# EAGLE board power_supply_module (EAGLE 8.2.0)
REV: D
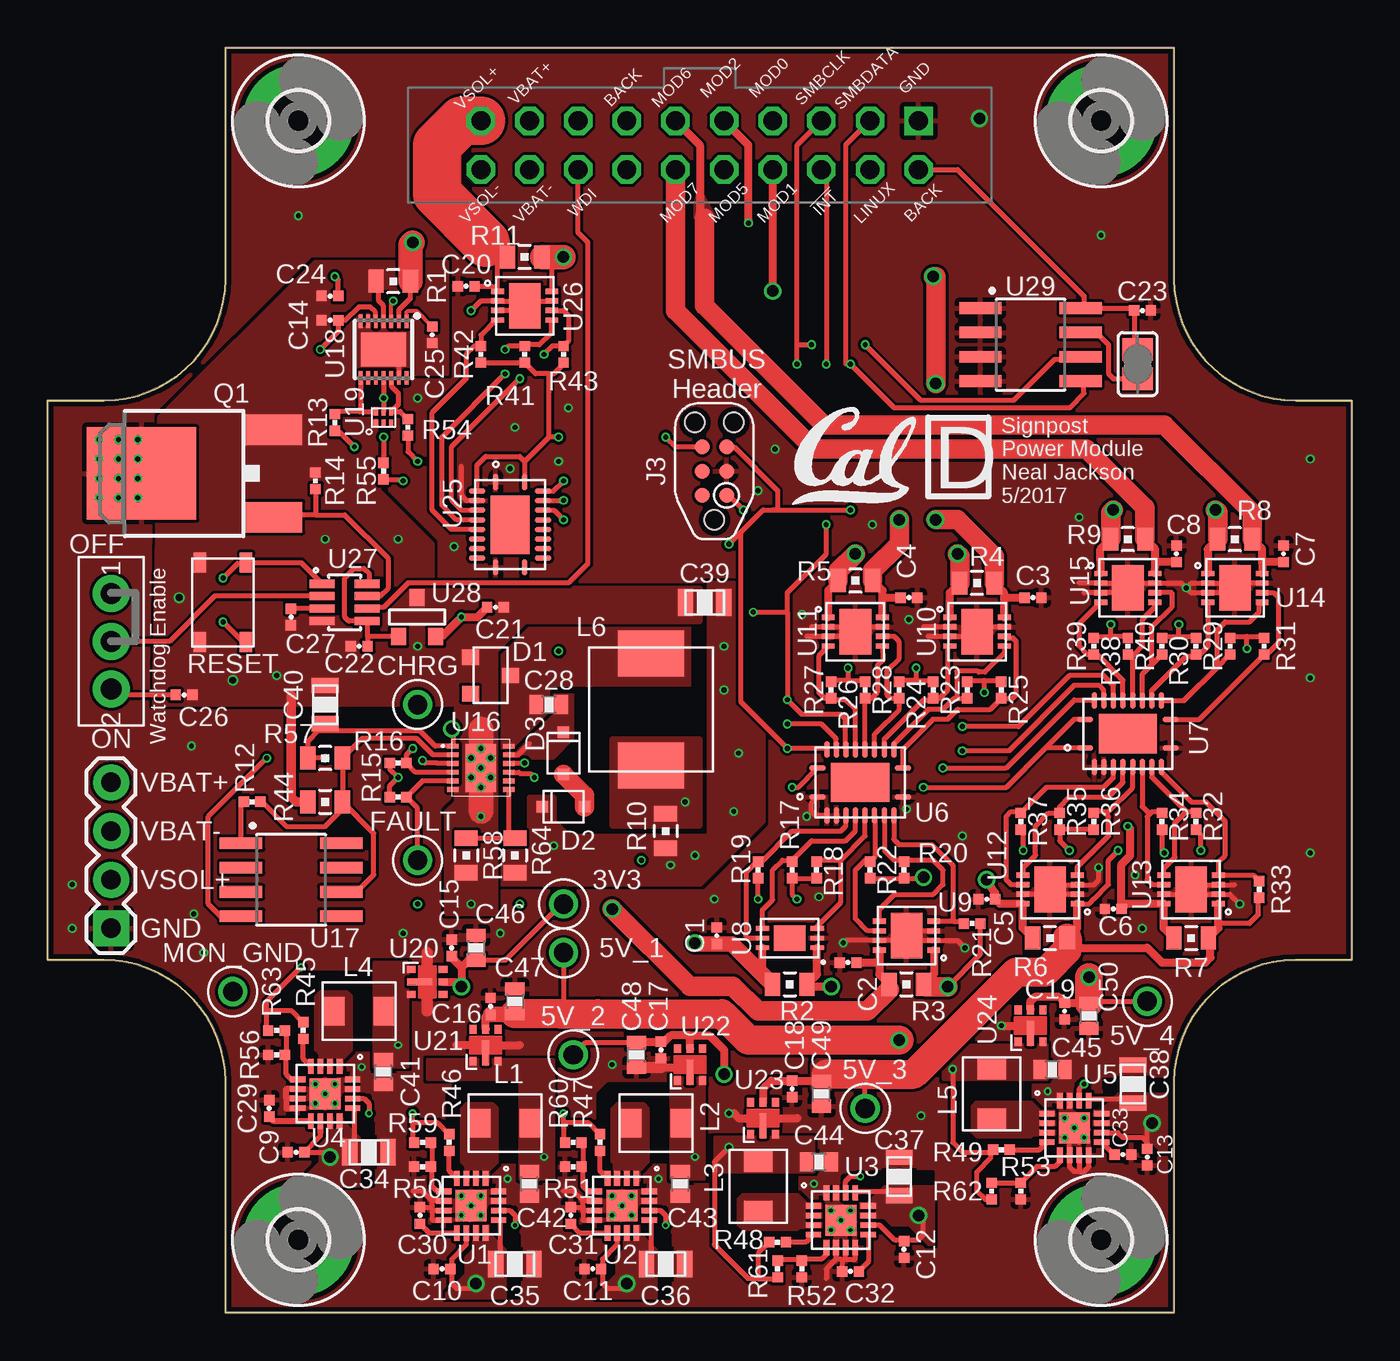
[diagram p8: board, top side]
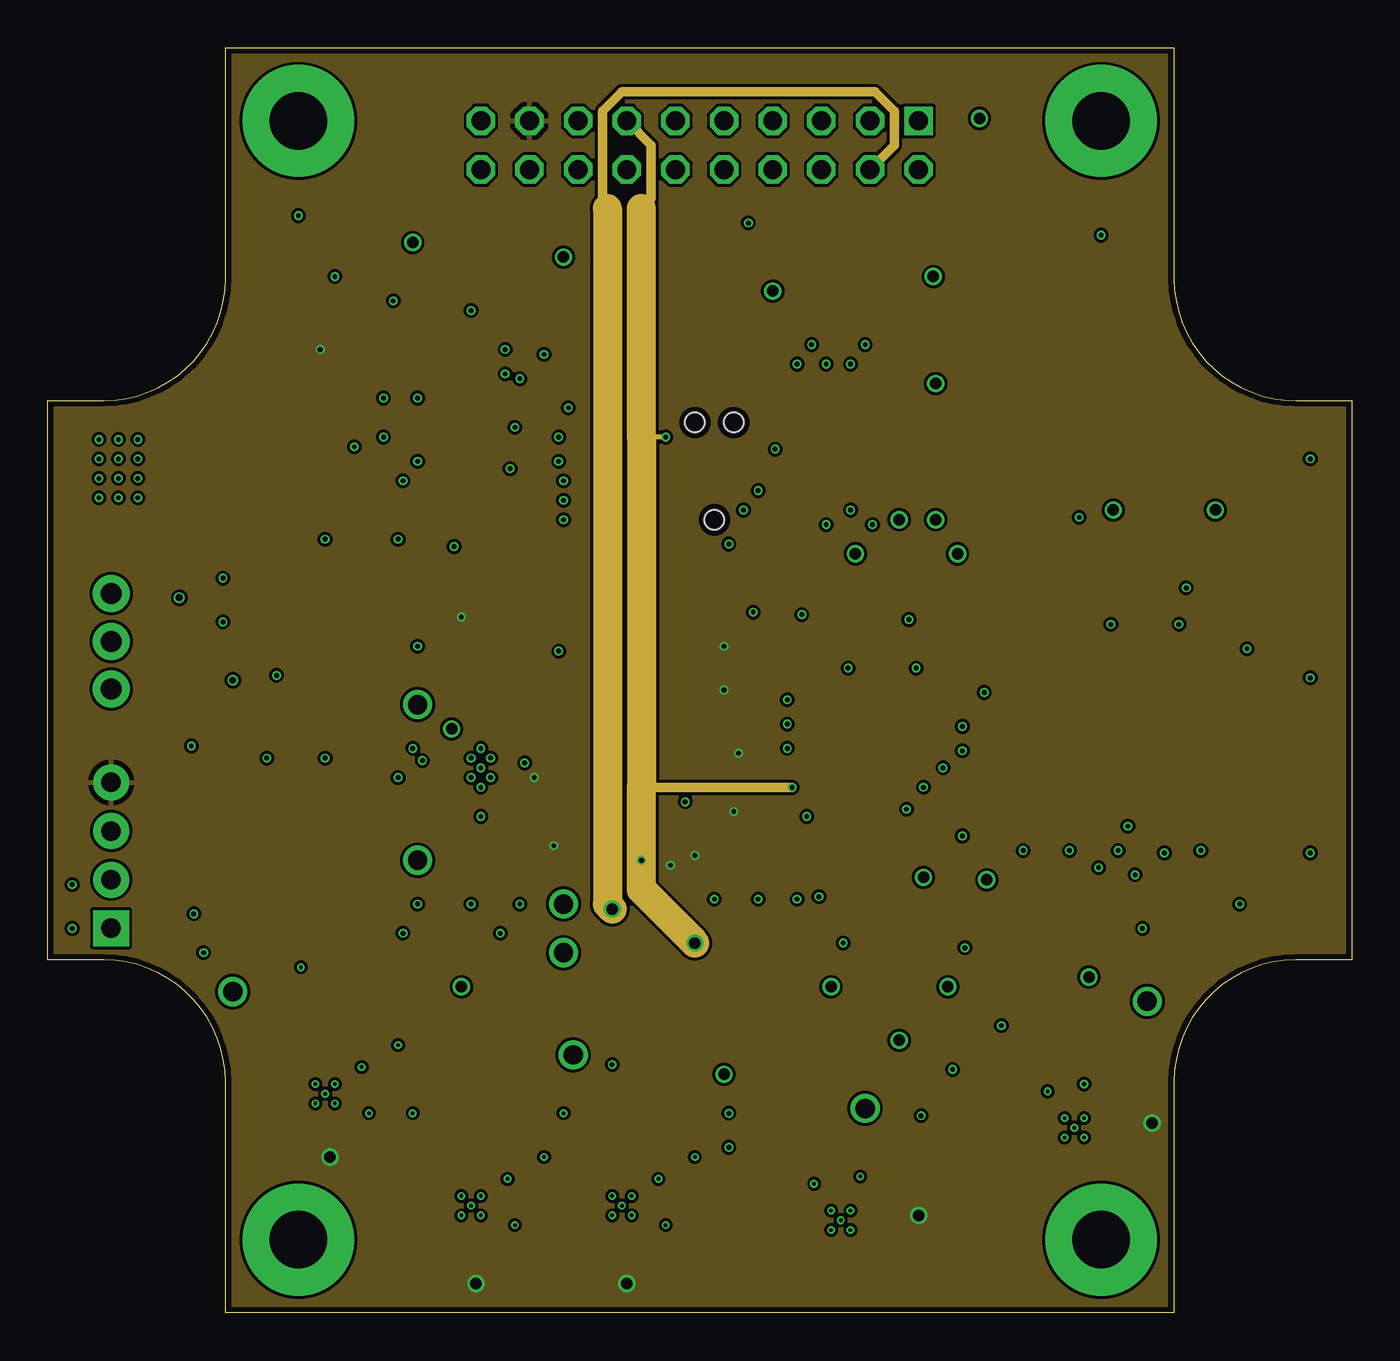
[diagram p9: board, inner layer Route2]
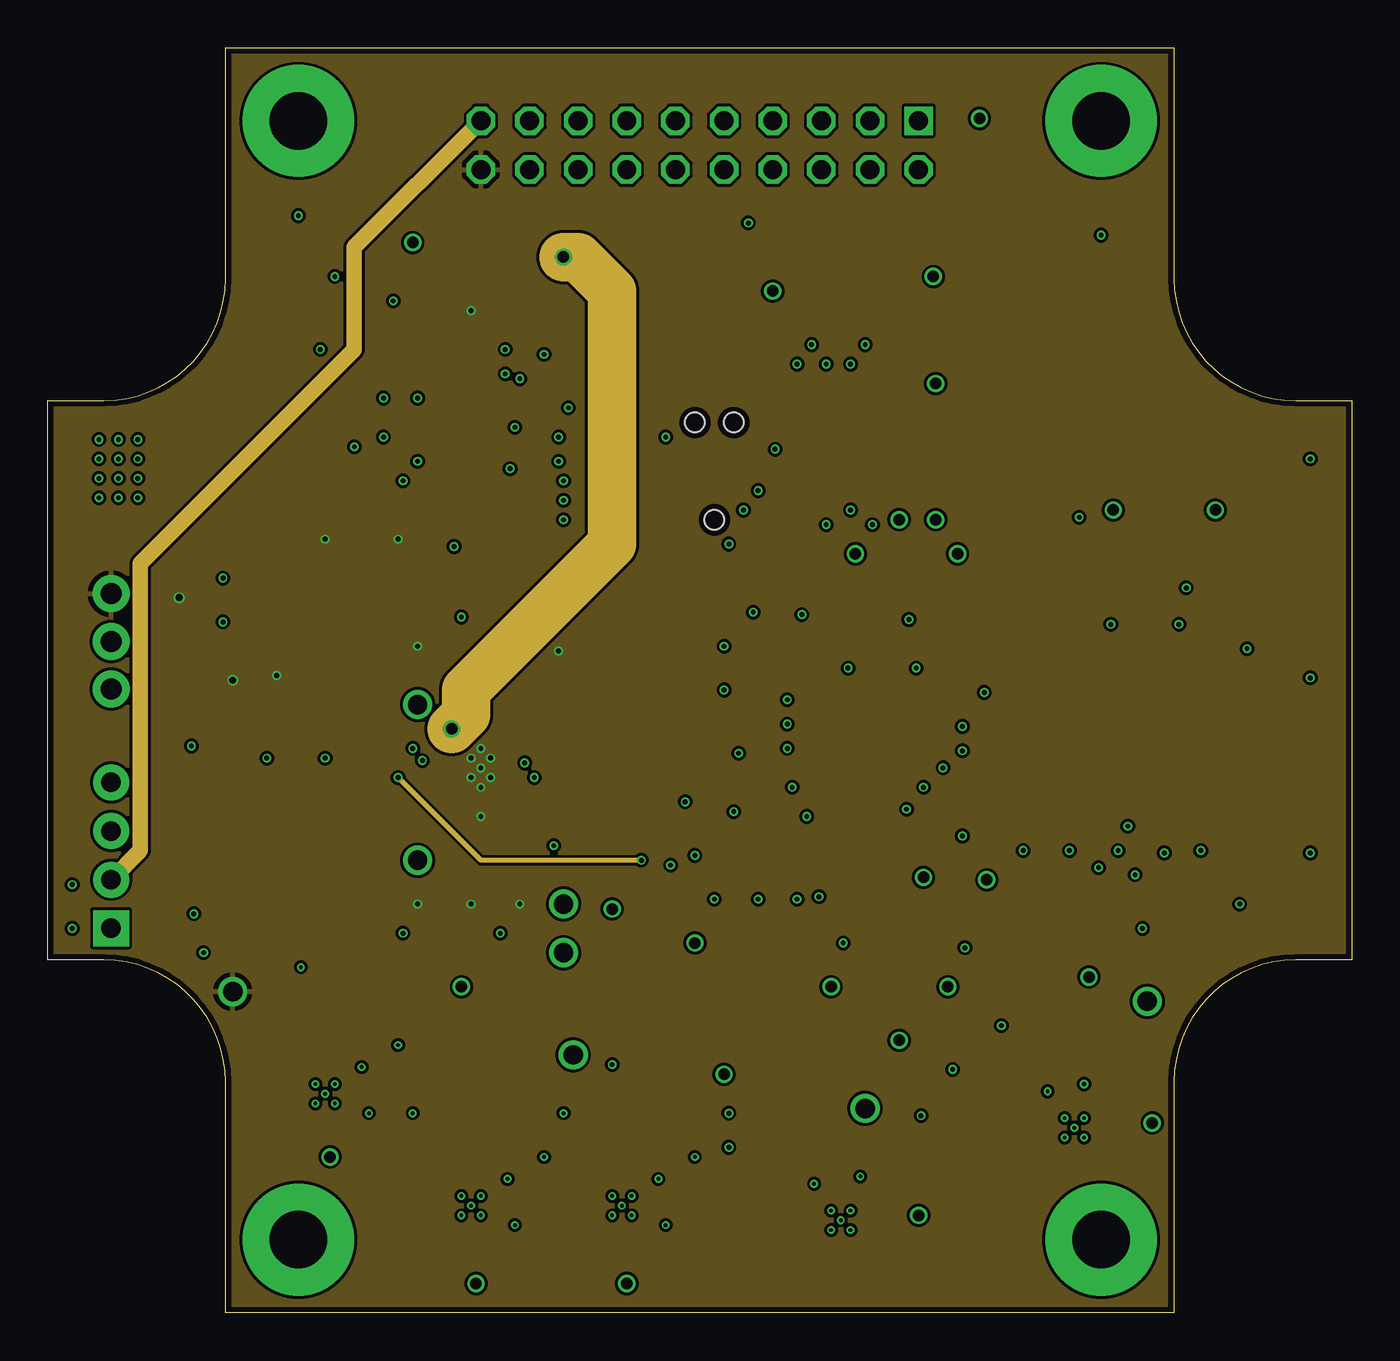
[diagram p10: board, inner layer Route15]
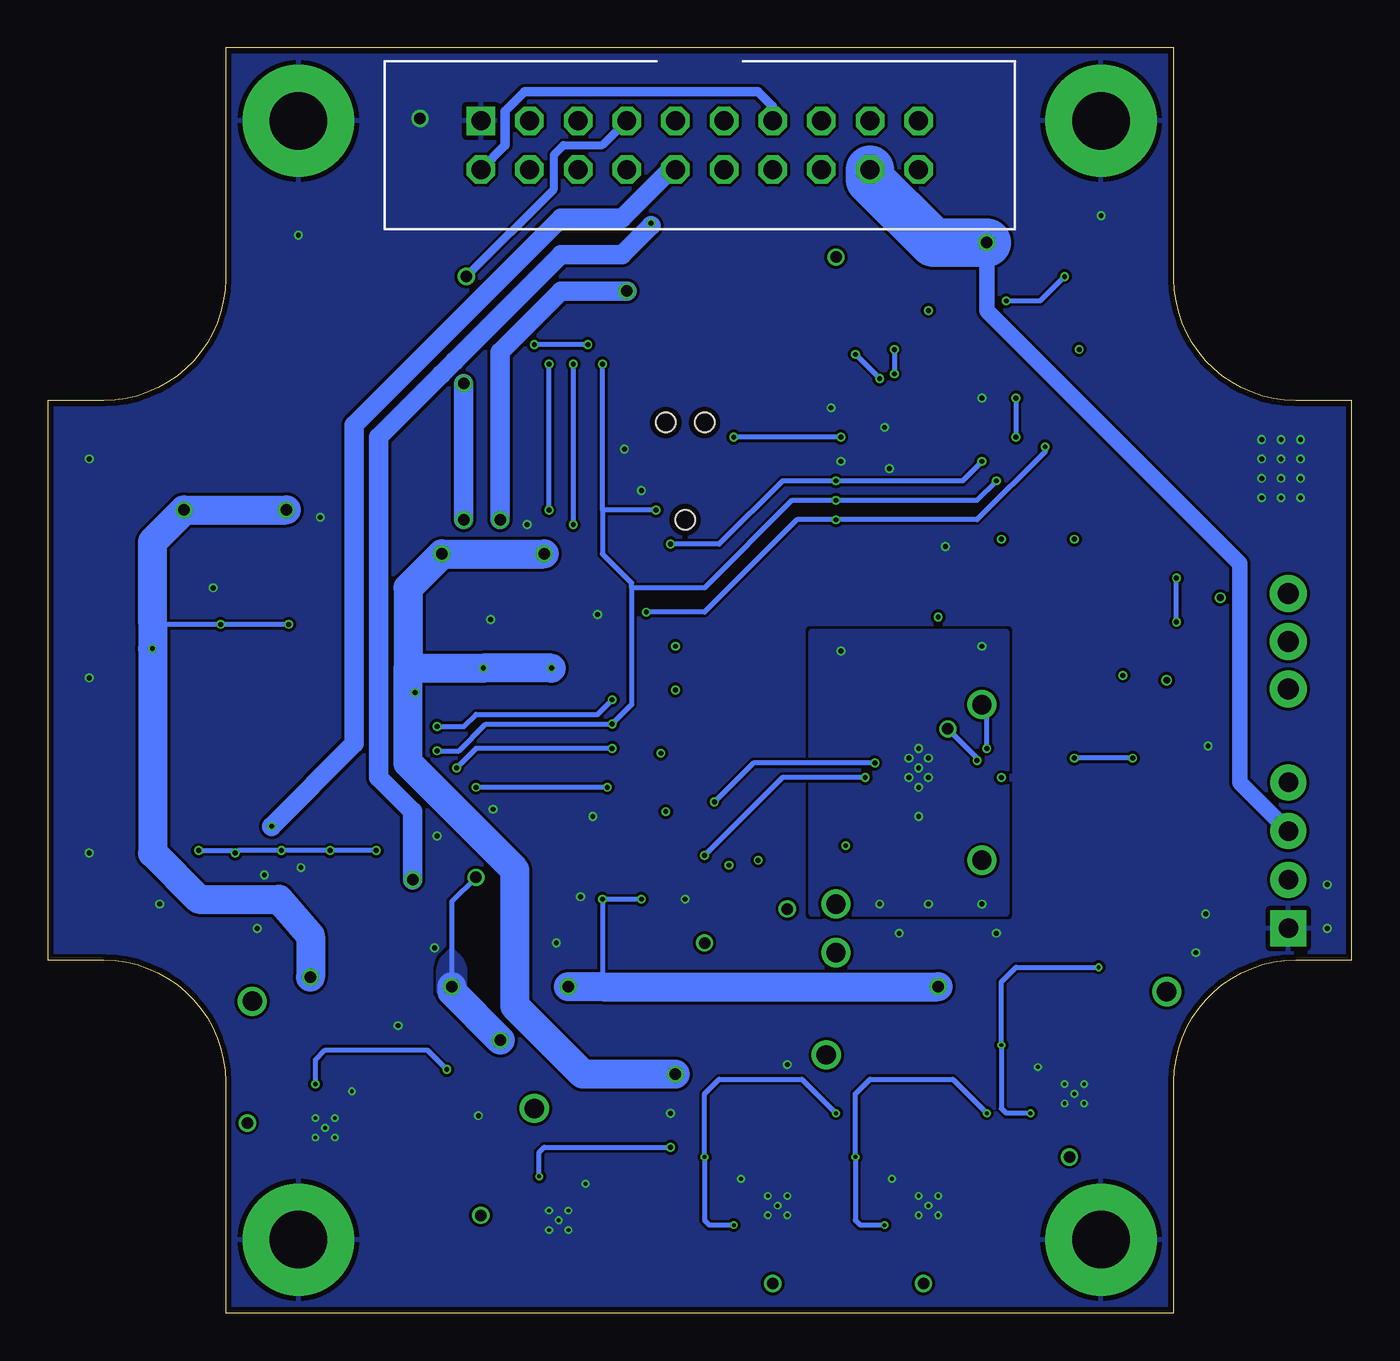
[diagram p11: board, bottom side, seen from below]

Size 68.07 x 66.04 mm. Coordinates in mm from the lower left corner, seen from the top.
Outline: 9.27,0 9.27,12.06 arc90 2.92,18.41 0,18.41 0,47.62 2.92,47.62 arc90 9.27,53.98 9.27,66.04 58.8,66.04 58.8,53.98 arc90 65.15,47.62 68.07,47.62 68.07,18.41 65.15,18.41 arc90 58.8,12.06 58.8,0 9.27,0
Copper layers (1+2*15+16): Top 0.0178mm / dielectric 59mil / Route2 0.0356mm / dielectric 0.1499mm / Route15 0.0356mm / dielectric 0.2007mm / Bottom 0.0178mm
Design rules "quickturn_co_kr_1oz_4lyr *": minimum track width 6mil, minimum drill 8mil, track to track 6mil, track to pad 6mil, pad to pad 6mil, via to via 6mil, smd to smd 6mil, copper to edge 12mil, drill to drill 12mil, minimum pad ring 8mil, minimum via ring 4mil, stop-mask expansion 3mil, vias tented up to drill 25mil, thermal gap 10mil
tRestrict: 46 lines

## Footprints (pad centres in the part's own frame; a part is rotated, then mirrored left to right if it is on the bottom)
TESTPOINT_0.040IN = drill 1.016: TESTPOINT 0,0
0402_CAP = smd 0.536 x 0.546: 1 -0.433,0; 2 0.433,0
0603_CAP = smd 0.7 x 1: 1 -0.65,0; 2 0.65,0
0805_CAP = smd 0.8 x 1.4: P$1 1,0; P$2 -1,0
SOT-23F = smd 0.8 x 0.9: P$1 -0.95,-1.05; P$2 0.95,-1.05; P$3 0,1.05
SOD323 = smd 0.6 x 0.6: P$1 -1.1,0; P$2 1.1,0
3,0-PAD = drill 3 pad 5.842: B3,0 0,0
MODULE_POWER = drill 0.991 square: 1 11.43,29.21 | drill 0.991 octagon: 2 11.43,26.67; 3 8.89,29.21; 4 8.89,26.67; 5 6.35,29.21; 6 6.35,26.67; 7 3.81,29.21; 8 3.81,26.67; 9 1.27,29.21; 10 1.27,26.67; 11 -1.27,29.21; 12 -1.27,26.67; 13 -3.81,29.21; 14 -3.81,26.67; 15 -6.35,29.21; 16 -6.35,26.67; 17 -8.89,29.21; 18 -8.89,26.67; 19 -11.43,29.21; 20 -11.43,26.67
TC2030-IDC-NL = smd 0.787 x 0.787: 1 -1.27,-0.635; 2 -1.27,0.635; 3 0,-0.635; 4 0,0.635; 5 1.27,-0.635; 6 1.27,0.635 | hole 1.016: -2.54,0; 2.54,1.016; 2.54,-1.016
1X04 = drill 1.016 pad 1.88 square: 1 0,0 | drill 1.016 pad 1.88: 2 2.54,0; 3 5.08,0; 4 7.62,0
IHL-1212BZ-11 = smd 1.2 x 1.5: P$1 -1.35,0; P$2 1.35,0
IHL-2525CZ = smd 2.413 x 3.429: P$1 -2.921,0; P$2 2.921,0
DPAK = smd 1.6 x 3: 1 -2.28,-5.31; 3 2.28,-5.31 | smd 4.826 x 5.715: 4 0,1.588
0805_RES = smd 0.8 x 1.2: 1 -0.9,0; 2 0.9,0
0402_RES = smd 0.536 x 0.546: 1 -0.433,0; 2 0.433,0
PTS810SJ = smd 1.05 x 0.65: 1 -2.075,1.2; 2 2.075,1.2; 3 2.075,-1.2; 4 -2.075,-1.2
TE_SSA12/SPDT = drill 1.092 pad 1.93: 1 -2.489,0; 2 2.489,0; IN 0,0
SJ = smd 1.168 x 1.6: 1 -0.762,0; 2 0.762,0
TQFN-16/3MM = smd 0.3 x 0.8: 1 -0.75,-1.43; 2 -0.25,-1.43; 3 0.25,-1.43; 4 0.75,-1.43; 9 0.75,1.43; 10 0.25,1.43; 11 -0.25,1.43; 12 -0.75,1.43 | smd 0.8 x 0.3: 5 1.43,-0.75; 6 1.43,-0.25; 7 1.43,0.25; 8 1.43,0.75; 13 -1.43,0.75; 14 -1.43,0.25; 15 -1.43,-0.25; 16 -1.43,-0.75 | smd 1.63 x 1.63: GND 0,0
QFN-N20 = smd 0.85 x 0.28: 1 -2.23,-0.75; 10 2.23,-0.75; 11 2.23,0.75; 20 -2.23,0.75 | smd 0.28 x 0.85: 2 -1.75,-1.73; 3 -1.25,-1.73; 4 -0.75,-1.73; 5 -0.25,-1.73; 6 0.25,-1.73; 7 0.75,-1.73; 8 1.25,-1.73; 9 1.75,-1.73; 12 1.75,1.73; 13 1.25,1.73; 14 0.75,1.73; 15 0.25,1.73; 16 -0.25,1.73; 17 -0.75,1.73; 18 -1.25,1.73; 19 -1.75,1.73 | smd 3.05 x 2.05: P$22 0,0
DFN-6-2MMX3MM = smd 0.25 x 0.7: 1 -0.5,-1.425; 2 0,-1.425; 3 0.5,-1.425; 4 0.5,1.425; 5 0,1.425; 6 -0.5,1.425 | smd 1.35 x 1.65: NC 0,0
DFN-8 = smd 0.28 x 0.675: P1 -0.75,-1.42; P2 -0.25,-1.42; P3 0.25,-1.42; P4 0.75,-1.42; P5 0.75,1.42; P6 0.25,1.42; P7 -0.25,1.42; P8 -0.75,1.42 | smd 2.38 x 1.65: P$1 0,0
DFN-12/3MM = smd 0.6 x 0.25: 1 -1.45,1.13; 2 -1.45,0.68; 3 -1.45,0.23; 4 -1.45,-0.23; 5 -1.45,-0.68; 6 -1.45,-1.13; 7 1.45,-1.13; 8 1.45,-0.68; 9 1.45,-0.23; 10 1.45,0.23; 11 1.45,0.68; 12 1.45,1.13 | smd 1.6 x 2.5: 13 0,0
SOIC-8 = smd 0.61 x 2.21: 1 -1.905,-2.616; 2 -0.635,-2.616; 3 0.635,-2.616; 4 1.905,-2.616; 5 1.905,2.616; 6 0.635,2.616; 7 -0.635,2.616; 8 -1.905,2.616
14-TDFN = smd 0.7 x 0.2: 1 -1.475,1.2; 2 -1.475,0.8; 3 -1.475,0.4; 4 -1.475,0; 5 -1.475,-0.4; 6 -1.475,-0.8; 7 -1.475,-1.2; 8 1.475,-1.2; 9 1.475,-0.8; 10 1.475,-0.4; 11 1.475,0; 12 1.475,0.4; 13 1.475,0.8; 14 1.475,1.2 | smd 1.78 x 2.35: 15 0,0
UDFN-6 = smd 0.42 x 0.22: P$1 -0.325,0.4; P$2 -0.325,0; P$3 -0.325,-0.4; P$4 0.325,-0.4; P$5 0.325,0; P$6 0.325,0.4
U-DFN2020-6 = smd 0.37 x 0.45: 1 -0.65,-0.825; 3 0.65,-0.825; 4 0.65,0.825; 5 0,0.825; 6 -0.65,0.825 | smd 0.37 x 1.3: 2 0,-0.4
SOT-23-8 = smd 0.42 x 1.3: 1 -0.975,-1.17; 2 -0.325,-1.17; 3 0.325,-1.17; 4 0.975,-1.17; 5 0.975,1.17; 6 0.325,1.17; 7 -0.325,1.17; 8 -0.975,1.17
SOT-23 = smd 0.787 x 0.889: 1 0.991,1.016; 2 -0.94,1.016; 3 0.025,-1.016

## Placement (x,y rotation side)
3V3  TEST_POINT_0.040IN  [TESTPOINT_0.040IN]  26.92,21.34 90 top
5V_1  TEST_POINT_0.040IN  [TESTPOINT_0.040IN]  26.92,18.8 90 top
5V_2  TEST_POINT_0.040IN  [TESTPOINT_0.040IN]  27.43,13.46 0 top
5V_3  TEST_POINT_0.040IN  [TESTPOINT_0.040IN]  42.67,10.67 90 top
5V_4  TEST_POINT_0.040IN  [TESTPOINT_0.040IN]  57.4,16.26 180 top
C1  0.1 uF  [0402_CAP]  34.92,19.68 90 top
C2  0.1 uF  [0402_CAP]  41.78,18.29 180 top
C3  0.1 uF  [0402_CAP]  51.44,37.34 0 top
C4  0.1 uF  [0402_CAP]  44.96,37.34 0 top
C5  0.1 uF  [0402_CAP]  49.02,21.59 180 top
C6  0.1 uF  [0402_CAP]  55.63,21.08 180 top
C7  0.1 uF  [0402_CAP]  64.52,39.62 90 top
C8  0.1 uF  [0402_CAP]  58.93,39.62 90 top
C9  0.1 uF  [0402_CAP]  12.95,8.38 180 top
C10  0.1 uF  [0402_CAP]  20.57,2.29 180 top
C11  0.1 uF  [0402_CAP]  28.45,2.29 180 top
C12  0.1 uF  [0402_CAP]  44.7,3.3 270 top
C13  0.1 uF  [0402_CAP]  57.4,8.13 270 top
C14  0.1 uF  [0402_CAP]  14.73,51.82 180 top
C15  0.1 uF  [0402_CAP]  21.08,19.05 90 top
C16  0.1 uF  [0402_CAP]  23.11,16 90 top
C17  0.1 uF  [0402_CAP]  32,13.72 270 top
C18  0.1 uF  [0402_CAP]  38.86,11.68 270 top
C19  0.1 uF  [0402_CAP]  53.09,15.75 270 top
C20  0.1 uF  [0402_CAP]  21.84,53.59 180 top
C21  0.1 uF  [0402_CAP]  23.37,36.83 0 top
C22  0.1 uF  [0402_CAP]  16.26,34.8 180 top
C23  0.1 uF  [0402_CAP]  57.15,52.32 0 top
C24  0.47 uF  [0402_CAP]  14.73,53.09 180 top
C25  0.47 uF  [0402_CAP]  20.07,51.05 270 top
C26  0.47 uF  [0402_CAP]  7.11,32.26 0 top
C27  0.82 uF  [0402_CAP]  12.7,36.32 270 top
C28  1 uF  [0603_CAP]  26.16,31.75 0 top
C29  3.3 nF  [0402_CAP]  11.56,10.67 270 top
C30  3.3 nF  [0402_CAP]  19.43,5.08 270 top
C31  3.3 nF  [0402_CAP]  27.3,5.08 270 top
C32  3.3 nF  [0402_CAP]  41.91,2.16 0 top
C33  3.3 nF  [0402_CAP]  56.13,8.26 180 top
C34  10 uF  [0805_CAP]  16.76,8.38 180 top
C35  10 uF  [0805_CAP]  24.38,2.54 180 top
C36  10 uF  [0805_CAP]  32.26,2.54 180 top
C37  10 uF  [0805_CAP]  44.45,7.11 270 top
C38  10 uF  [0805_CAP]  56.64,11.94 270 top
C39  10 uF  [0805_CAP]  34.29,37.08 0 top
C40  10 uF  [0805_CAP]  14.48,31.75 270 top
C41  22 uF  [0603_CAP]  17.53,12.57 90 top
C42  22 uF  [0603_CAP]  25.15,6.73 90 top
C43  22 uF  [0603_CAP]  33.02,6.73 90 top
C44  22 uF  [0603_CAP]  40.26,7.87 180 top
C45  22 uF  [0603_CAP]  52.45,12.7 180 top
C46  22 uF  [0603_CAP]  22.35,19.05 270 top
C47  22 uF  [0603_CAP]  24.38,16.26 270 top
C48  22 uF  [0603_CAP]  30.73,13.46 90 top
C49  22 uF  [0603_CAP]  40.39,11.43 90 top
C50  22 uF  [0603_CAP]  54.36,15.49 90 top
CHRG  TEST_POINT_0.040IN  [TESTPOINT_0.040IN]  19.3,31.75 0 top
D1  DIODE_SCHOTTKYSOT-23F  [SOT-23F]  23.11,33.27 270 top
D2  [SOD323]  26.92,26.42 0 top
D3  DIODE_SCHOTTKYSOD323  [SOD323]  26.92,29.21 270 top
FAULT  TEST_POINT_0.040IN  [TESTPOINT_0.040IN]  19.3,23.62 0 top
H1  MOUNT-PAD-ROUND3.0  [3,0-PAD]  13.08,62.23 0 top
H2  MOUNT-PAD-ROUND3.0  [3,0-PAD]  54.99,62.23 0 top
H3  MOUNT-PAD-ROUND3.0  [3,0-PAD]  13.08,3.81 0 top
H4  MOUNT-PAD-ROUND3.0  [3,0-PAD]  54.99,3.81 0 top
J1  MODULE_POWER  [MODULE_POWER]  34.04,33.02 0 top
J3  TC2030-FTDI-I2C  [TC2030-IDC-NL]  34.8,43.94 90 top
JP1  [1X04]  3.3,20.07 90 top
L1  2.2 uH  [IHL-1212BZ-11]  23.88,9.91 0 top
L2  2.2 uH  [IHL-1212BZ-11]  31.75,9.91 0 top
L3  2.2 uH  [IHL-1212BZ-11]  37.08,6.6 90 top
L4  2.2 uH  [IHL-1212BZ-11]  16.26,15.75 0 top
L5  2.2 uH  [IHL-1212BZ-11]  49.28,11.43 90 top
L6  6.8uH  [IHL-2525CZ]  31.5,31.5 270 top
MON_GND  TEST_POINT_0.040IN  [TESTPOINT_0.040IN]  9.65,16.76 0 top
Q1  MOSFET-NCHANNELFDD8580  [DPAK]  6.48,43.81 90 top
R1  0.010 Ω  [0805_RES]  18.03,53.85 180 top
R2  0.017 Ω  [0805_RES]  38.73,17.14 0 top
R3  0.017 Ω  [0805_RES]  44.83,17.14 0 top
R4  0.017 Ω  [0805_RES]  48.51,38.1 180 top
R5  0.017 Ω  [0805_RES]  42.16,38.23 180 top
R6  0.017 Ω  [0805_RES]  52.32,19.56 0 top
R7  0.017 Ω  [0805_RES]  59.69,19.56 0 top
R8  0.017 Ω  [0805_RES]  61.98,40.39 180 top
R9  0.017 Ω  [0805_RES]  56.39,40.39 180 top
R10  0.05 Ω  [0805_RES]  32.26,25.15 270 top
R11  0.05 Ω  [0805_RES]  24.89,55.12 180 top
R12  1 kΩ  [0402_RES]  10.67,26.67 180 top
R13  1 kΩ  [0402_RES]  14.99,46.48 270 top
R14  1 MΩ  [0402_RES]  13.97,43.43 270 top
R15  1 MΩ  [0402_RES]  18.29,26.92 180 top
R16  1 MΩ  [0402_RES]  18.29,28.7 180 top
R17  2 kΩ  [0402_RES]  38.86,23.11 270 top
R18  2 kΩ  [0402_RES]  40.13,23.11 270 top
R19  2 kΩ  [0402_RES]  37.08,23.11 270 top
R20  2 kΩ  [0402_RES]  44.7,23.11 270 top
R21  2 kΩ  [0402_RES]  48.26,20.32 0 top
R22  2 kΩ  [0402_RES]  42.93,23.11 270 top
R23  2 kΩ  [0402_RES]  48.01,32.51 90 top
R24  2 kΩ  [0402_RES]  46.23,32.51 90 top
R25  2 kΩ  [0402_RES]  49.78,32.51 90 top
R26  2 kΩ  [0402_RES]  42.67,32.51 90 top
R27  2 kΩ  [0402_RES]  40.89,32.51 90 top
R28  2 kΩ  [0402_RES]  44.45,32.51 90 top
R29  2 kΩ  [0402_RES]  61.72,34.8 90 top
R30  2 kΩ  [0402_RES]  59.94,34.8 90 top
R31  2 kΩ  [0402_RES]  63.5,34.8 90 top
R32  2 kΩ  [0402_RES]  59.94,25.65 270 top
R33  2 kΩ  [0402_RES]  63.25,22.1 270 top
R34  2 kΩ  [0402_RES]  58.17,25.65 270 top
R35  2 kΩ  [0402_RES]  52.83,25.65 270 top
R36  2 kΩ  [0402_RES]  54.61,25.65 270 top
R37  2 kΩ  [0402_RES]  50.8,25.65 270 top
R38  2 kΩ  [0402_RES]  56.39,34.8 90 top
R39  2 kΩ  [0402_RES]  54.61,34.8 90 top
R40  2 kΩ  [0402_RES]  58.17,34.8 90 top
R41  2 kΩ  [0402_RES]  24.89,50.04 270 top
R42  2 kΩ  [0402_RES]  22.61,50.04 270 top
R43  2 kΩ  [0402_RES]  26.92,50.04 270 top
R44  23.2 kΩ  [0805_RES]  14.48,26.67 0 top
R45  100 kΩ  [0402_RES]  13.34,14.73 90 top
R46  100 kΩ  [0402_RES]  20.95,8.89 90 top
R47  100 kΩ  [0402_RES]  28.83,8.89 90 top
R48  100 kΩ  [0402_RES]  38.1,3.68 180 top
R49  100 kΩ  [0402_RES]  49.78,8.51 180 top
R50  130 kΩ  [0402_RES]  19.56,7.62 0 top
R51  130 kΩ  [0402_RES]  27.43,7.62 0 top
R52  130 kΩ  [0402_RES]  39.37,2.29 90 top
R53  130 kΩ  [0402_RES]  50.8,6.35 90 top
R54  150 Ω  [0402_RES]  18.8,46.23 270 top
R55  150 Ω  [0402_RES]  17.53,43.94 270 top
R56  240 kΩ  [0402_RES]  11.94,13.46 0 top
R57  301 kΩ  [0805_RES]  14.48,28.96 180 top
R58  340 kΩ  [0805_RES]  21.84,23.88 270 top
R59  680 kΩ  [0402_RES]  19.56,8.89 180 top
R60  680 kΩ  [0402_RES]  27.43,8.89 180 top
R61  680 kΩ  [0402_RES]  38.1,2.29 270 top
R62  680 kΩ  [0402_RES]  49.28,6.35 270 top
R63  750 kΩ  [0402_RES]  11.94,14.73 180 top
R64  953 kΩ  [0805_RES]  24.38,23.88 270 top
RESET  PTS810SJ  [PTS810SJ]  9.14,37.08 270 top
S1  TE_SSA12/SPDT  [TE_SSA12/SPDT]  3.3,35.05 270 top
SJ1  [SJ]  56.9,49.53 270 top
U1  TLV62130  [TQFN-16/3MM]  22.1,5.59 180 top
U2  TLV62130  [TQFN-16/3MM]  29.97,5.59 180 top
U3  TLV62130  [TQFN-16/3MM]  41.4,4.83 270 top
U4  TLV62130  [TQFN-16/3MM]  14.48,11.43 180 top
U5  TLV62130  [TQFN-16/3MM]  53.59,9.65 270 top
U6  PCA9544AQFN-N20  [QFN-N20]  42.42,27.69 0 top
U7  PCA9544AQFN-N20  [QFN-N20]  56.39,30.23 0 top
U8  LTC2941  [DFN-6-2MMX3MM]  38.73,19.56 90 top
U9  LTC2943  [DFN-8]  44.83,19.68 90 top
U10  LTC2943  [DFN-8]  48.51,35.56 270 top
U11  LTC2943  [DFN-8]  42.16,35.56 270 top
U12  LTC2943  [DFN-8]  52.32,22.1 90 top
U13  LTC2943  [DFN-8]  59.69,22.1 90 top
U14  LTC2943  [DFN-8]  61.98,37.85 270 top
U15  LTC2943  [DFN-8]  56.39,37.85 270 top
U16  LT3652  [DFN-12/3MM]  22.61,28.45 0 top
U17  LM234  [SOIC-8]  12.7,22.61 270 top
U18  MAX17205  [14-TDFN]  17.53,50.29 270 top
U19  ESDR0502N  [UDFN-6]  17.53,46.74 90 top
U20  AP22814  [U-DFN2020-6]  19.81,17.27 270 top
U21  AP22814  [U-DFN2020-6]  22.86,13.97 0 top
U22  AP22814  [U-DFN2020-6]  33.53,12.95 0 top
U23  AP22814  [U-DFN2020-6]  37.34,10.16 0 top
U24  AP22814  [U-DFN2020-6]  51.31,14.99 0 top
U25  PCA9544AQFN-N20  [QFN-N20]  24.13,41.15 270 top
U26  LTC2943  [DFN-8]  24.89,52.58 270 top
U27  MAX6746  [SOT-23-8]  15.49,37.08 270 top
U28  3.3V  [SOT-23]  19.3,36.32 180 top
U29  M24C01WMN  [SOIC-8]  51.31,50.55 270 top
U$1  [UCB_CAL_200MIL]  38.86,42.16 0 top

## Tracks (layer width: path | path; a pad name or v marks a point on that pad's centre or on a via)
3V3ROUT  (via drill 0.2 pad 0.25)
  Top 0.254: U4.14 16.51,11.18 16.76,10.92 v16.76,10.41 | R63.2 11.43,14.81 11.43,15.75 | R45.2 12.75,15.75 11.43,15.75 | 11.43,15.75 11.43,16.26 v13.21,18.03
  Bottom 0.254: v16.76,10.41 18.03,10.41 18.29,10.67 v18.29,13.97 18.29,17.27 17.53,18.03 v13.21,18.03
  pour Top (no thermals): 17.02,12.83 18.8,12.83 18.8,18.29 17.02,18.29
5V_1ROUT  (via drill 0.2 pad 0.25)
  Top 0.254: U1.14 24.13,5.34 24.38,5.08 v24.38,4.57 | R59.2 19.05,8.96 19.05,9.91 | 19.05,9.91 v19.05,10.41 | R46.2 20.37,9.91 19.05,9.91
  Bottom 0.254: v24.38,4.57 25.65,4.57 25.91,4.83 v25.91,8.13 25.91,11.43 25.15,12.19 20.83,12.19 v19.05,10.41
  pour Top (no thermals): 24.64,6.99 26.42,6.99 26.42,13.21 19.81,13.21 19.81,12.19 24.64,12.19
5V_2ROUT  (via drill 0.2 pad 0.25)
  Top 0.254: U2.14 32,5.34 32.26,5.08 v32.26,4.57 | R60.2 26.92,8.96 26.92,9.91 | 26.92,9.91 v26.92,10.41 | R47.2 28.25,9.91 26.92,9.91
  Bottom 0.254: v32.26,4.57 33.53,4.57 33.78,4.83 v33.78,8.13 33.78,11.43 33.02,12.19 28.7,12.19 v26.92,10.41
  pour Top (no thermals): 32.51,6.99 34.29,6.99 34.29,12.45 32.51,12.45
5V_3ROUT  (via drill 0.2 pad 0.25, 0.25)
  Top 0.254: U3.14 41.65,6.85 41.91,7.11 v42.42,7.11 | R61.2 38.02,1.78 37.08,1.78 | 37.08,1.78 36.58,1.78 34.8,3.56 34.8,7.87 v35.56,8.64 | R48.2 37.08,3.1 37.08,1.78
  Bottom 0.254: v42.42,7.11 42.42,8.38 42.16,8.64 v35.56,8.64
  pour Top (no thermals): 40.01,7.37 40.01,9.14 34.8,9.14 34.8,7.37
5V_4ROUT  (via drill 0.25)
  Top 0.254: U5.14 53.84,11.68 v54.1,11.94 | v47.24,12.7 47.24,8.89 47.75,8.38 49.22,8.38 | 49.22,8.38 R49.2 | 49.22,8.38 49.22,8.08 48.51,7.37 48.51,6.35 48.95,5.92 R62.2
  Bottom 0.254: v54.1,11.94 54.1,13.21 53.59,13.72 48.26,13.72 v47.24,12.7
  pour Top (no thermals): 52.2,12.19 52.2,13.97 46.74,13.97 46.74,12.19
!INT  (via drill 0.25)
  Top 0.254: J1.6 40.64,59.44 v40.64,49.53 | U7.17 55.64,32.75 55.12,33.27 53.34,33.27 50.67,30.61 v47.75,30.61 | U6.17 41.66,29.43 41.66,30.99 41.4,31.24 39.37,31.24 v38.61,32 38.61,36.58 | 38.61,36.58 38.61,37.59 40.64,39.62 v40.64,41.15 | U25.17 26.43,41.9 v26.92,41.4 | v36.83,36.58 38.61,36.58 | R13.2 15.24,45.97 v16,45.21
  Bottom 0.254: v40.64,49.53 v40.64,41.15 | v47.75,30.61 46.35,30.61 45.72,31.24 39.37,31.24 v38.61,32 | v16,45.21 16,44.96 19.56,41.4 v26.92,41.4 28.96,41.4 33.78,36.58 v36.83,36.58
BOOST
  Top 0.254: U16.11 24.53,29.13 24.66,29.26 24.69,29.26 25.15,29.72
  pour Top (no thermals): 23.88,29.21 23.88,28.96 26.42,28.96 27.43,29.97 27.43,32.26 26.42,32.26 26.42,31.24 24.38,29.21
CHRG  (via drill 0.25)
  Top 0.254: U16.4 19.2,28.22 R16.1 18.72,29.14 v19.05,29.46
  Bottom 0.254: v19.05,29.46 19.05,31.5 CHRG.TESTPOINT
CHRG_FAULT
  Top 0.254: U16.5 19.57,27.77 R15.1 19.3,26.34 FAULT.TESTPOINT
GND  (via drill 0.2, 0.2 pad 0.25, 0.25, 0.6)
  Top 0.152: 61.97,22.35 61.98,22.35
  Top 0.254: v54.86,23.24 54.86,22.61 54.61,22.35 U12.P3 52.57,22.35 U12.P$1 | U6.2 40.08,25.96 39.88,26.16 39.88,26.63 U6.1 | 20.07,5.84 U1.6 | 20.06,5.34 U1.7 | 20.06,5.34 20.06,4.83 20.07,4.83 20.66,4.83 U1.8 | 20.07,5.59 20.07,5.84 | 20.07,5.59 20.07,5.34 20.06,5.34 | 20.07,5.59 19.99,5.51 C30.1 | 20.07,5.84 19.56,6.35 19.05,6.35 | 27.94,5.84 U2.6 | 27.94,5.34 U2.7 | 27.94,5.34 27.94,4.83 28.53,4.83 U2.8 | 27.94,5.59 27.94,5.84 | 27.94,5.59 27.94,5.34 | 27.94,5.59 27.86,5.51 C31.1 | 27.94,5.84 27.43,6.35 26.92,6.35 | 41.15,2.79 U3.6 | 41.65,2.79 U3.7 | 41.65,2.79 42.16,2.79 42.16,3.38 U3.8 | 41.4,2.79 41.15,2.79 | 41.4,2.79 41.65,2.79 | 41.4,2.79 41.48,2.72 C32.1 | 41.15,2.79 40.64,2.29 40.64,1.78 | U5.6 | U5.8 54.36,8.21 54.36,7.62 54.1,7.37 53.85,7.37 | U25.3 21.86,42.4 21.59,42.67 21.59,44.2 | 53.84,8.89 v54.1,9.14 | U5.6 53.34,7.62 53.59,7.37 53.85,7.37 | U5.7 53.84,7.37 53.85,7.37 | U5.6 53.34,8.89 v53.09,9.14 | 39.88,35.81 U11.P2 41.91,35.81 42.04,35.69 | 42.04,35.69 U11.P$1 41.91,35.31 U11.P3 39.63,35.31 39.62,35.31 | U11.P7 42.67,35.81 42.55,35.69 42.04,35.69 | 45.97,35.31 U10.P3 47.75,35.31 48.01,35.56 U10.P$1 | U10.P7 49.02,35.81 | U10.P2 45.72,35.81 | 54.1,37.59 U15.P3 56.14,37.6 U15.P$1 | 53.85,38.1 U15.P2 U15.P7 59.19,38.1 v59.44,37.85 | v59.44,37.85 59.69,38.1 U14.P2 61.73,38.1 U14.P$1 | v59.44,37.85 59.69,37.6 U14.P3 61.73,37.6 U14.P$1 | U14.P7 62.23,38.1 U14.P$1 | U9.P3 45.08,19.93 U9.P$1 | U9.P$1 45.08,19.43 U9.P2 47.49,19.43 v47.88,19.05 | U9.P$1 44.58,19.43 U9.P7 41.66,19.43 v41.53,19.3 v41.52,19.31 | U12.P7 52.07,21.85 U12.P$1 | U12.P2 52.57,21.85 U12.P$1 | U13.P7 59.44,21.85 U13.P$1 | U13.P$1 59.94,21.85 U13.P2 61.72,21.85 v62.23,21.34
  Top 0.254: U13.P3 59.94,22.35 U13.P$1 | U13.P3 61.22,22.35 | U13.P3 61.97,22.35
  Top 0.305: U4.6 12.45,11.68 12.45,11.18 | 12.45,11.18 12.45,10.67 13.04,10.67 U4.8 | U20.2 19.81,17.27 | U4.7 12.45,11.18
  Top 0.406: 32,12.81 33.27,12.81 U22.2 | U21.2 22.86,14.22 22.61,14.22 22.35,13.97 | 22.35,13.97 21.34,13.97 | 22.35,13.97 24.64,13.97 | 37.34,10.16 37.34,10.41 37.59,10.41 37.85,10.16 39.12,10.16 | U23.2 37.34,10.16 | v35.56,10.41 35.81,10.41 36.07,10.16 37.34,10.16 | U24.2 50.91,14.99 v49.78,14.99
  Top 0.61: 32,13.21 C17.2 32,12.81 C48.1 | 19.81,18.8 19.81,17.27 19.81,15.75
  other vias: 53.85,41.53 43.05,41.15 57.15,20.07 44.96,36.2 39.37,36.45 14.48,11.43 14.99,10.92 13.97,10.92 14.99,11.94 13.97,11.94 16.38,12.83 22.1,5.59 22.61,5.08 21.59,5.08 22.61,6.1 21.59,6.1 24,6.99 29.97,5.59 30.48,5.08 29.46,5.08 30.48,6.1 29.46,6.1 31.88,6.99 41.4,4.83 41.91,5.33 41.91,4.32 40.89,5.33 40.89,4.32 40.01,6.73 53.59,9.65 54.1,10.16 53.09,10.16 52.2,11.56 47.75,24.89 44.83,26.29 34.8,21.59 24.13,44.07 24.38,46.23 48.64,62.36 29.46,12.95 8.13,18.8 7.49,29.59 45.59,10.29 13.08,57.28 54.99,56.26 65.91,44.58 65.91,33.15 65.91,24 21.21,40.01 27.18,47.24 26.67,44.45 19.3,47.75 18.54,19.81 40.26,21.72 56.77,22.86 37.08,42.93 3.68,45.59 2.67,45.59 2.67,44.58 7.62,20.83 1.27,20.07 1.27,22.35 3.68,44.58 3.68,43.56 2.67,43.56 3.68,42.55 2.67,42.55 4.7,45.59 4.7,44.58 4.7,43.56 4.7,42.55 37.97,45.09 23.62,19.81 39.62,25.91
  pour Top (rank 6): -1.27,67.31 68.58,67.31 68.58,-1.27 -1.27,-1.27
  pour Bottom (rank 6): -1.27,67.31 68.58,67.31 68.58,-1.27 -0.51,-0.51
  pour Top (rank 2, no thermals): 17.27,6.6 17.27,11.05 16.76,11.56 15.37,11.56 15.24,11.43 15.24,12.19 15.62,12.19 16,12.57 16,12.95 16.26,13.21 16.51,13.21 16.76,12.95 16.76,12.45 18.8,12.45 18.8,6.6
  pour Top (rank 2, no thermals): 24.89,0.76 24.89,5.21 24.38,5.71 22.99,5.71 22.86,5.59 22.86,6.35 23.24,6.35 23.62,6.73 23.62,7.11 23.88,7.37 24.13,7.37 24.38,7.11 24.38,6.86 24.64,6.6 26.42,6.6 26.42,0.76
  pour Top (rank 2, no thermals): 32.77,0.76 32.77,5.21 32.26,5.71 30.86,5.71 30.73,5.59 30.73,6.35 31.11,6.35 31.5,6.73 31.5,7.11 31.75,7.37 32,7.37 32.26,7.11 32.26,6.86 32.51,6.6 34.29,6.6 34.29,0.76
  pour Top (rank 2, no thermals): 46.23,7.62 41.78,7.62 41.27,7.11 41.27,5.71 41.4,5.59 40.64,5.59 40.64,5.97 40.26,6.35 39.88,6.35 39.62,6.6 39.62,6.86 39.88,7.11 40.13,7.11 40.39,7.37 40.39,9.14 46.23,9.14
  pour Top (rank 2, no thermals): 58.42,12.45 53.98,12.45 53.47,11.94 53.47,10.54 53.59,10.41 52.83,10.41 52.83,10.79 52.45,11.18 52.07,11.18 51.82,11.43 51.82,11.68 52.07,11.94 52.32,11.94 52.58,12.19 52.58,13.97 58.42,13.97
MONITOR_GND  (via drill 0.25, 0.35)
  Top 0.254: U18.13 18.33,50 18.29,50.04 17.78,50.04 U18.15 | 23.36,52.85 U26.P2 | U26.P$1 24.62,52.85 | U26.P7 25.14,52.83 U26.P$1 | U26.P2 24.64,52.83 U26.P$1 | U26.P3 24.64,52.33 U26.P$1 | U26.P2 22.6,52.83 v22.1,52.32 | U18.4 17.53,52.58 17.27,52.83 17.27,53.46 R1.2
  Top 0.508: R44.1 12.95,26.67 12.7,26.92 12.7,32.26
  Top 1.27: 22.61,30.48 U16.13 22.61,26.16
  other vias: 6.86,37.34 9.65,33.02 19.3,34.8 18.29,40.39 22.61,29.46 22.1,21.34 11.94,33.27 19.3,21.34 24.64,21.34 26.67,34.54 14.48,40.39 22.61,25.91 22.1,28.96 23.11,28.96 22.61,28.45 22.1,27.94 23.11,27.94 22.61,27.43
  pour Top (no thermals): 5.59,31.75 5.84,46.74 13.97,54.86 20.83,54.86 20.83,49.02 17.27,49.02 17.27,42.93 20.07,40.13 20.07,37.85 34.04,37.85 34.04,36.07 24.89,36.07 23.37,34.54 23.37,20.83 20.83,20.83 20.83,26.16 21.34,26.67 21.34,31.75
  pour Route15 (rank 6): -1.27,67.31 -1.27,-1.27 68.58,-1.27 68.58,67.31
  pour Bottom: 18.03,35.56 18.03,20.83 28.19,20.83 28.19,35.56
N$1
  pour Top (no thermals): 14.22,12.7 14.22,13.46 13.97,13.72 13.97,16.51 14.22,16.76 15.62,16.76 15.88,16.51 15.88,13.72 15.37,13.21 15.37,12.7
N$2
  cutout Top: 16,13.72 16.76,13.72 16.76,17.78 13.72,17.78 13.21,17.27 13.21,15.75 13.72,15.75 13.72,16.76 13.97,17.02 16,17.02
N$3
  Top 0.254: U1.9 19.92,4.16 C30.2
N$4
  cutout Top: 16.51,6.6 17.02,6.6 17.02,9.91 16.51,9.91
N$5
  Top 0.254: U1.4 20.95,7.41 R46.1
N$6
  Top 0.254: R59.1 20.07,8.81 20.07,7.7 R50.2 20.07,7.54 20.07,6.6 20.33,6.34 U1.5
N$7
  cutout Top: 23.62,7.87 24.38,7.87 24.38,11.94 21.34,11.94 20.83,11.43 20.83,9.91 21.34,9.91 21.34,10.92 21.59,11.18 23.62,11.18
N$8
  Top 0.254: U2.9 27.79,4.16 C31.2
N$9
  pour Top (no thermals): 29.59,6.86 29.59,7.75 29.46,7.87 29.46,10.67 29.72,10.92 31.11,10.92 31.37,10.67 31.37,7.87 30.86,7.37 30.86,6.86
N$10
  Top 0.254: U2.4 28.83,7.41 R47.1
N$11
  Top 0.254: R60.1 27.94,8.81 27.94,7.7 R51.2 27.94,7.54 27.94,6.6 28.21,6.34 U2.5
N$12
  cutout Top: 31.5,7.87 32.26,7.87 32.26,11.94 29.21,11.94 28.7,11.43 28.7,9.91 29.21,9.91 29.21,10.92 29.46,11.18 31.5,11.18
N$13
  cutout Top: 32,0.76 32.51,0.76 32.51,4.06 32,4.06
N$14
  cutout Top: 24.13,0.76 24.64,0.76 24.64,4.06 24.13,4.06
N$15
  Top 0.305: U4.9 11.79,10 C29.2
N$16
  pour Top (no thermals): 21.84,6.86 21.84,7.62 arc5 21.59,7.87 21.59,10.67 21.84,10.92 23.24,10.92 23.5,10.67 23.5,7.87 22.99,7.37 22.99,6.86
N$17
  Top 0.254: U3.9 42.83,2.65 C32.2
N$18
  Top 0.254: U4.4 13.34,13.25 R45.1
N$19
  Top 0.254: R63.1 12.45,14.66 12.45,13.54 R56.2 12.45,13.39 12.45,12.45 12.71,12.18 U4.5
N$20  (via drill 0.25)
  Top 0.254: RESET.2 10.2,35.01 v9.14,36.07 | v9.14,38.35 9.91,39.12 10.3,39.12 RESET.1 13.22,39.16 U27.1
  Bottom 0.254: v9.14,36.07 v9.14,38.35
N$21
  Top 0.254: U7.5 56.13,27.69 55.37,26.92 53.34,26.92 52.83,26.42 R35.1 52.25,26.09 51.56,25.4 51.56,23.88 50.9,23.22 U12.P5
N$22
  Top 0.254: 55.12,26.16 55.37,25.91 55.37,24.89 53.74,23.26 U12.P4 | 55.12,26.16 54.69,26.16 R36.1 | 55.12,26.16 55.37,26.16 56.64,27.43 U7.6
N$23
  Top 0.254: U7.12 59.31,31.96 61.05,33.69 | 61.05,33.69 R29.1 | 61.05,33.69 61.05,35.65 61.47,36.07 62.74,36.07 63.25,36.58 63.25,36.95 U14.P5
N$24
  Top 0.254: U7.13 57.64,32.49 59.44,34.29 59.87,34.29 R30.1 60.15,34.37 60.58,34.8 60.58,37.07 U14.P4
N$25
  Top 0.254: U7.11 60.11,30.98 R31.1 | R31.1 63.63,34.37 | U14.P6 64,37.6 64.26,37.34 64.26,34.99 63.63,34.37 | R31.1 63.63,34.37
N$26
  Top 0.254: U7.15 56.64,34.11 R38.1 | 56.59,34.37 R38.1 | U15.P5 57.81,36.85 57.15,36.19 57.15,34.8 56.72,34.37 R38.1
N$27
  Top 0.254: U7.16 56.14,33.02 54.79,34.37 R39.1 54.28,34.37 53.85,34.8 53.85,35.98 U15.P4
N$28
  cutout Top: 17.02,53.34 17.78,53.34 17.78,51.82 17.02,51.82
N$29
  pour Top (no thermals): 40.39,4.45 39.24,4.45 39.12,4.32 36.32,4.32 36.07,4.57 36.07,5.97 36.32,6.22 39.12,6.22 39.62,5.71 40.39,5.71
N$30
  Top 0.254: U3.4 39.58,3.68 R48.1
N$31
  Top 0.254: R61.1 38.17,2.79 39.3,2.79 R52.2 39.45,2.79 40.39,2.79 40.65,3.06 U3.5
N$32
  cutout Top: 39.12,6.35 39.12,7.11 35.05,7.11 35.05,4.06 35.56,3.56 37.08,3.56 37.08,4.06 36.07,4.06 35.81,4.32 35.81,6.35
N$33
  cutout Top: 46.23,6.86 46.23,7.37 42.93,7.37 42.93,6.86
N$34
  Top 0.254: C33.2 55.67,8.26 U5.9
N$35
  pour Top (no thermals): 52.58,9.27 51.44,9.27 51.31,9.14 48.51,9.14 48.26,9.4 48.26,10.79 48.51,11.05 51.31,11.05 51.82,10.54 52.58,10.54
N$36
  Top 0.254: U5.4 51.77,8.51 R49.1
N$37
  Top 0.254: U5.5 52.84,7.89 52.58,7.62 51.64,7.62 R53.2 R62.1
N$38
  cutout Top: 51.31,11.18 51.31,11.94 47.24,11.94 47.24,8.89 47.75,8.38 49.28,8.38 49.28,8.89 48.26,8.89 48.01,9.14 48.01,11.18
N$39
  cutout Top: 58.42,11.68 58.42,12.19 55.12,12.19 55.12,11.68
N$41
  Top 0.254: U27.3 C27.1
N$42
  Top 0.254: U18.12 17.93,48.37 18.29,48.01 18.29,47.42 U19.P$4 | U19.P$4 18.22,47.06 | U19.P$4 18.4,47.06 R54.1
N$43
  Top 0.254: 37.31,20.29 U8.4 37.31,21.03 37.84,21.55 37.84,23.11 38.35,23.62 38.79,23.62 R17.1 38.86,23.62 39.88,24.64 41.66,24.64 42.16,25.15 U6.5
N$44
  Top 1.016: D2.P$2 28.02,27.01 D3.P$2
N$45
  Top 0.254: C26.1 3.61,32.26 S1.2
N$46
  Top 0.254: U7.14 57.14,33.34 57.37,33.56 | 57.37,33.56 R40.1 | U15.P6 58.67,37.59 58.67,36.83 57.62,35.78 | 57.61,35.78 57.62,35.78 | 57.62,35.78 57.61,35.78 | 57.37,33.56 57.61,33.81 57.61,35.78
N$47
  Top 0.254: 41.4,23.62 40.21,23.62 R18.1 | 41.4,23.62 41.4,21.42 40.16,20.18 U8.3 | 41.4,23.62 42.67,24.89 U6.6
N$48
  Top 0.254: U7.4 55.63,28.48 55.63,27.94 55.12,27.43 52.15,27.43 R37.1 50.73,26.16 50.29,26.16 50.04,25.91 50.04,22.61 50.3,22.35 U12.P6
N$49
  Top 0.254: 59.44,26.16 59.87,26.16 R32.1 | U7.8 57.64,27.96 59.44,26.16 | U13.P5 58.27,23.19 58.85,23.77 58.85,25.58 59.44,26.16
N$50
  Top 0.254: U7.9 58.14,28.22 59.69,26.67 60.45,26.67 61.47,25.65 61.47,23.88 61.12,23.52 U13.P4 62.93,22.85 R33.1 63.18,22.6
N$51
  Top 0.254: 57.53,26.04 57.4,25.91 57.4,22.61 57.66,22.35 U13.P6 | 57.53,26.04 57.66,26.16 58.09,26.16 R34.1 | U7.7 57.14,26.43 57.53,26.04
N$52
  Top 0.254: U6.12 44.17,29.69 45.97,31.5 46.74,31.5 47.32,32.08 47.5,32.08 | 47.5,32.08 R23.1 | U10.P5 49.93,34.44 48.94,33.44 48.61,33.44 48.56,33.49 47.45,33.49 47.45,32.12 47.5,32.08 | 47.5,32.09 47.5,32.08
N$53
  Top 0.254: U6.13 43.67,29.95 45.72,32 46.15,32 R24.1 46.56,32.08 46.99,32.51 46.99,34.71 U10.P4
N$54
  Top 0.254: R25.1 49.71,32 49.71,31.93 | R25.1 50.37,32.08 50.55,32.26 50.55,34.48 50.55,35.07 50.39,35.23 50.02,35.23 U10.P6 | U6.11 44.65,29.41 46.23,30.99 46.99,30.99 47.5,31.5 49.2,31.5 R25.1
N$55
  Top 0.254: U11.P5 43.59,34.06 43.31,33.78 43.31,32.38 43,32.08 R26.1 U6.15
N$56
  Top 0.254: U6.16 42.16,31.5 41.66,32 40.97,32 R27.1 40.56,32.08 40.26,32.38 40.26,34.22 arc-45 40.33,34.4 U11.P4
N$57
  Top 0.254: U6.14 43.17,30.21 44.45,31.5 R28.1 43.99,32.08 43.81,32.26 43.81,33.53 44.45,34.16 44.45,34.95 arc45 44.38,35.13 44.2,35.31 43.59,35.31 arc-45 U11.P6
N$58  (via drill 0.25)
  Top 0.254: v17.53,45.72 R55.1 | U18.11 v17.53,47.75 U19.P$5
  Bottom 0.254: v17.53,47.75 v17.53,45.72
N$59
  Top 0.254: U17.1 10.08,26.52 R12.2
N$60  (via drill 0.25)
  Top 0.203: U18.3 17.93,52.72 v18.03,52.83
  Top 0.254: C24.1 15.16,53.92 v14.99,54.1
  Bottom 0.254: v18.03,52.83 16.26,52.83 v14.99,54.1
N$61
  Top 0.254: 16.26,47.06 U19.P$6 | 16.26,47.06 14.99,47.06 R13.1 | 16.26,47.06 16.33,47.13 U18.8
N$62
  Top 0.203: U18.1 18.73,52.22 18.81,52.31 19.24,52.31 C25.1
N$63
  Top 0.254: U27.2 8.71,37.41 6.35,35.05 S1.IN
N$64
  Top 0.254: U29.7 54.74,51.18 55.37,50.55 55.37,49.02 55.63,48.77 SJ1.2
N$67
  Top 0.254: U6.4 41.66,25.94 41.66,25.4 41.4,25.15 38.86,25.15 37.26,23.55 R19.1 37.01,23.55 36.45,22.99 36.45,19.68 36.58,19.56 U8.5
N$68
  Top 0.254: U9.P5 43.41,21.05 44.2,21.84 46.23,21.84 46.74,22.35 46.74,23.11 46.23,23.62 44.7,23.62 | 44.7,23.62 44.2,23.62 43.69,24.13 43.69,25.94 U6.8 | R20.1 44.7,23.62
N$69
  Top 0.254: 11.03,41.3 Q1.1 11.91,41.66 13.97,41.66 | U27.7 17.34,37.41 17.78,37.85 17.78,39.37 15.49,41.66 13.97,41.66 | R14.2 13.97,41.66
  Top 0.305: Q1.1 11.4,41.91
N$70
  Top 0.254: 44.45,24.43 46.18,24.43 47.24,23.37 47.24,20.43 | 44.45,24.43 44.42,24.43 | U6.9 44.17,24.71 44.45,24.43 | 47.24,20.43 U9.P4 | 47.24,20.43 47.71,20.43 R21.1
N$71
  Top 0.254: U6.7 43.18,25.94 43.18,23.8 R22.1 42.85,23.62 42.67,23.62 42.16,23.11 42.16,20.57 42.8,19.93 U9.P6
N$72
  Top 0.254: 16.69,35.31 C22.1 | 16.69,35.31 16.69,36.08 U27.5 15.71,36.11 15.49,36.32 15.49,38.35 16,38.86 16.51,38.86 16.76,38.61 16.76,38.16 U27.8 16.62,38.1 | U28.1 16.69,35.31
N$73  (via drill 0.25)
  Top 0.254: v25.91,50.04 26.34,50.47 R43.1 27.18,50.73 27.18,52.07 26.92,52.33 U26.P6 | U25.4 21.6,41.9 21.08,42.42 21.08,45.21 v24.64,48.77
  Bottom 0.254: v25.91,50.04 v24.64,48.77
N$74
  Top 0.254: U26.P4 23.4,51.85 22.61,51.05 R42.1 22.28,50.47 21.84,50.04 21.84,48.77 20.07,46.99 20.07,41.91 21.08,40.9 U25.6
N$75  (via drill 0.25)
  Top 0.254: v23.88,50.29 24.05,50.47 R41.1 24.97,50.55 25.65,50.55 26.29,51.18 26.29,51.8 U26.P5 | U25.5 21.34,41.4 20.57,42.16 20.57,45.72 v23.88,49.02
  Bottom 0.254: v23.88,50.29 v23.88,49.02
SCL  (via drill 0.25)
  Top 0.254: J1.5 39.12,60.96 39.12,50.55 | U7.18 55.12,31.98 55.12,32.51 54.86,32.77 53.59,32.77 50.16,29.34 v47.75,29.34 | U6.18 41.15,29.44 41.15,29.97 40.39,30.73 v38.61,30.73 | U25.18 26.9,42.4 v26.92,42.42 | R55.2 18.47,43.51 v18.54,43.43 | 39.12,50.55 v39.88,50.55 | 50.67,47.88 50.55,47.75 | 50.67,47.88 52.58,49.78 53.8,49.78 U29.6 | v39.12,49.53 39.12,50.55 | v36.32,41.91 35.56,42.67 J3.1 | 50.67,47.88 50.44,47.65 45.57,47.65 v42.67,50.55
  Bottom 0.254: 37.59,37.85 37.59,31.75 v38.61,30.73 45.21,30.73 46.61,29.34 v47.75,29.34 | 37.59,37.85 37.59,38.1 39.12,39.62 39.12,41.91 | 39.12,41.91 v39.12,49.53 | 37.59,37.85 33.78,37.85 29.21,42.42 v26.92,42.42 19.56,42.42 v18.54,43.43 | v39.88,50.55 v42.67,50.55 | v36.32,41.91 39.12,41.91
SDA  (via drill 0.25)
  Top 0.254: U7.19 54.59,32 53.59,32 50.04,28.45 v46.74,28.45 | J1.3 41.66,60.96 41.66,49.53 v41.91,49.53 44.2,47.24 53.34,47.24 54.1,48.01 54.1,48.46 U29.5 | U6.19 40.62,29.46 v38.61,29.46 36.2,31.88 36.2,40.77 | 38.1,41.91 37.85,41.91 | 38.1,41.91 v41.91,41.91 | U25.19 26.39,42.9 v26.92,43.43 | R54.2 18.8,44.96 v19.3,44.45 | 38.1,41.91 38.1,42.93 35.81,45.21 J3.5 | 36.2,40.77 v35.56,40.13 | 36.2,40.77 37.34,41.91 38.1,41.91
  Bottom 0.254: v38.61,29.46 45.72,29.46 v46.74,28.45 | v41.91,41.91 v41.91,49.53 | v19.3,44.45 20.32,43.43 v26.92,43.43 29.72,43.43 33.02,40.13 v35.56,40.13
SENSE  (via drill 0.25)
  Top 0.254: U16.10 24.08,28.7 v24.89,28.7
  Bottom 0.254: v24.89,28.7 31.24,28.7 v33.27,26.67
  pour Top (no thermals): 29.46,29.97 34.04,29.97 34.04,25.4 29.46,25.4
SW
  pour Top (rank 2, no thermals): 23.62,34.29 23.62,29.46 24.38,29.46 26.16,31.24 26.16,32.77 33.53,32.77 33.53,35.81 25.15,35.81
VBAT+  (via drill 0.25, 0.6)
  Top 0.203: U18.5 17.11,51.79
  Top 0.254: U4.13 16,10.59 16,8.89 | U2.10 29.72,3.56 28.96,2.79 28.96,2.36 | 28.96,2.36 C11.1 | 28.96,2.36 28.96,1.52 29.21,1.27 29.97,1.27 | U2.13 31.5,4.74 31.5,3.05 | U1.10 21.85,3.56 21.08,2.79 21.08,2.36 | 21.08,2.36 C10.1 | 21.08,2.36 21.08,1.52 21.34,1.27 22.1,1.27 | U1.13 23.62,4.74 23.62,3.05 | U3.10 43.43,4.58 44.2,3.81 44.63,3.81 | 44.63,3.81 C12.1 | 44.63,3.81 45.47,3.81 45.72,4.06 45.72,4.83 | U3.13 42.25,6.35 43.94,6.35 | U5.13 54.44,11.18 56.13,11.18 | 57.4,8.89 C13.1 | 57.4,8.89 57.4,9.65 v57.66,9.91 | U5.10 55.88,9.4 56.13,9.14 57.15,9.14 57.4,8.89 | 14.23,9.4 14.23,9.22 C9.1 14.48,8.38 v14.73,8.13 | U16.9 24.59,28.22 24.66,28.14 25.2,28.14 v25.4,27.94 | v14.22,50.29 15.16,51.23 C14.1 15.53,51.82 16.24,52.53 16.81,52.53 17.11,52.23 17.11,51.79
  Top 0.305: U4.10 14.23,9.4
  Top 0.406: U28.2 20.57,35.31 v21.59,36.32 22.43,36.32 C21.1
  Bottom 0.254: v33.78,23.88 29.72,27.94 v25.4,27.94
  other vias: 22.35,1.52 30.23,1.52 45.47,5.08 26.42,24.38 32.51,23.37 35.81,26.16 36.07,29.21 35.31,32.51 35.31,34.8
  pour Top (no thermals): 14.61,10.16 15.37,10.16 15.37,10.03 16.26,9.14 16.26,6.6 13.21,6.6 13.21,6.86 14.22,7.87 14.22,8.76 14.61,9.14
  pour Top (no thermals): 30.1,4.57 30.86,4.57 30.86,4.19 31.75,3.3 31.75,0.76 28.7,0.76 28.7,1.02 29.72,2.03 29.72,2.92 30.1,3.3
  pour Top (no thermals): 22.23,4.57 22.99,4.57 22.99,4.19 23.88,3.3 23.88,0.76 20.83,0.76 20.83,1.02 21.84,2.03 21.84,2.92 22.23,3.3
  pour Top (no thermals): 42.42,4.95 42.42,5.71 42.8,5.71 43.69,6.6 46.23,6.6 46.23,3.56 45.97,3.56 44.96,4.57 44.07,4.57 43.69,4.95
  pour Top (no thermals): 54.61,9.78 54.61,10.54 54.99,10.54 55.88,11.43 58.42,11.43 58.42,8.38 58.17,8.38 57.15,9.4 56.26,9.4 55.88,9.78
  pour Route2 (rank 6): -1.27,67.31 -1.27,-1.27 68.58,-1.27 68.58,67.31
  pour Top (rank 3, no thermals): 34.54,38.1 35.81,38.1 35.81,31.75 37.34,30.23 37.34,25.65 34.04,22.35 23.62,22.35 23.62,23.62 25.15,25.15 25.15,26.92 26.42,26.92 26.42,25.65 27.18,24.89 34.54,24.89
VBAT-  (via drill 0.6)
  Top 0.254: R1.1 18.93,52.97 18.33,52.37 U18.2
  Top 1.27: R1.1 18.93,55.76 v19.05,55.88
  Bottom 0.813: v19.05,55.88 19.05,52.32 5.84,39.12 5.84,27.69 JP1.3
  Bottom 2.54: J1.18 25.15,59.17 23.5,57.52 23.49,57.52 21.84,55.88 v19.05,55.88
VCC_3V3  (via drill 0.25, 0.6)
  Top 0.254: v39.12,21.59 38.86,21.84 R17.2 R18.2 | C46.2 23.88,18.4 26.92,21.45 3V3.TESTPOINT | v37.08,21.59 R19.2
  Top 0.406: v40.89,17.02 39.76,17.02 R2.2 40.16,17.67 U8.1 | U20.5 21.59,17.27 v21.59,17.02 21.59,18.03 | C15.1 21.08,18.54 21.59,18.03 | C46.2 21.96,18.4 21.59,18.03
  Bottom 0.254: v37.08,21.59 v39.12,21.59 39.12,17.02
  Bottom 1.524: v21.59,17.02 39.12,17.02 v40.89,17.02
VCC_5V_1  (via drill 0.6)
  Top 0.254: R22.2 R20.2 45.67,22.68 v45.72,22.73 | v46.99,17.02 48.69,18.72 R21.2 | 28.96,15.86 28.7,15.61 | 5V_1.TESTPOINT 26.92,15.86 26.67,15.61
  Top 0.406: U9.P1 46.26,17.67 R3.2 45.86,17.02 | U21.5 22.86,15.49 23.04,15.49 C16.1
  Top 0.813: C16.1 24.09,15.57 C47.2
  Top 1.016: v46.99,17.02 45.86,17.02
  Top 1.524: v44.45,14.22 36.58,14.22 35.19,15.61 28.7,15.61 26.67,15.61 C47.2
  Bottom 0.254: v46.99,17.02 46.99,21.46 v45.72,22.73
  Bottom 1.524: v46.99,17.02 46.99,16.76 v44.45,14.22
  pour Bottom: 46.23,17.02 46.23,17.76 arc-45 46.6,18.66 46.99,19.05 47.38,18.66 arc-45 47.75,17.76 47.75,16.76 46.23,16.76
VCC_5V_2  (via drill 0.25, 0.6)
  Top 0.254: v48.9,32.38 48.9,33.02 | 48.9,33.02 49.71,33.02 R25.2 | R23.2 48.01,33.02 48.9,33.02 | 45.34,33.02 v45.34,33.66 | 45.34,33.02 46.15,33.02 R24.2 | 45.34,33.02 44.52,33.02 R28.2 | v41.78,33.66 41.78,33.02 | 41.78,33.02 42.6,33.02 R26.2 | 41.78,33.02 40.97,33.02 R27.2 | 5V_2.TESTPOINT 28.08,14.11 C48.2
  Top 0.406: 30.77,14.15 C17.1 32.18,14.15 32.51,14.48 33.53,14.48 | 33.53,14.48 34.54,14.48 35.31,13.72 v35.31,12.45 | U22.5 33.53,14.48 | R5.2 40.74,37.71 U11.P1 | U10.P1 47.09,37.58 R4.2
  Top 0.61: C48.2 30.77,14.15
  Top 1.016: R4.2 47.61,39.51 v47.5,39.62 | R5.2 41.26,38.72 v42.16,39.62
  Bottom 0.254: v48.9,32.38 48.9,33.17 arc-45 48.97,33.35 49.28,33.66
  Bottom 1.524: v41.78,33.66 v45.34,33.66 49.28,33.66 | v42.16,39.62 v47.5,39.62 49.28,37.85 49.28,33.66 | v35.31,12.45 40.13,12.45 43.69,16 43.69,23.11 49.28,28.7 49.28,33.66
VCC_5V_3  (via drill 0.25)
  Top 0.254: R36.2 R35.2 52.83,24.64 v53.34,24.13 | R34.2 58.17,24.13 v58.29,24 | v60.2,24.13 60.2,24.97 R32.2 | R33.2 63.18,21.6 63.18,20.76 62.74,20.32 61.12,20.32 | 5V_3.TESTPOINT 42.67,12.45 | U12.P1 54.37,21.35 54.65,21.63 55.37,22.35 55.37,23.62 v55.88,24.13 | C49.2 40.39,12.19 | v50.93,24.13 50.93,25.09 R37.2
  Top 0.406: U23.5 37.34,11.68 37.77,12.12 C18.1 40.35,12.12 C49.2 | 60.71,19.67 R7.2 | R7.2 61.12,20.08 61.12,20.32 U13.P1 | R7.2 60.71,19.44 60.71,18.54 60.45,18.29 58.17,18.29 57.4,19.05 53.73,19.05 R6.2 53.75,20.08 U12.P1 | 40.39,12.19 40.64,12.45
  Top 1.524: R6.2 53.22,18.93 52.07,17.78 50.55,17.78 45.21,12.45 42.67,12.45 40.64,12.45
  Bottom 0.254: v60.2,24.13 58.42,24.13 v58.29,24 58.17,24.13 v55.88,24.13 v53.34,24.13 v50.93,24.13
  pour Top (no thermals): 39.88,11.68 40.89,11.68 40.89,13.21 40.13,13.21 39.88,12.95
VCC_5V_4  (via drill 0.25, 0.6)
  Top 0.254: R38.2 56.39,35.31 55.5,35.31 | 55.5,35.31 v55.5,35.94 | R39.2 54.66,35.23 54.74,35.31 55.5,35.31 | R40.2 58.22,35.23 58.29,35.31 59.05,35.31 | 59.05,35.31 v59.05,35.94 | 59.05,35.31 59.87,35.31 R30.2 | R29.2 61.77,35.23 61.85,35.31 62.61,35.31 | 62.61,35.31 63.42,35.31 R31.2 | v62.61,34.67 62.61,35.31 | 5V_4.TESTPOINT 54.47,16.26 C50.2
  Top 0.406: C50.2 54.32,16.18 C19.1 52.76,16.51 51.56,16.51 51.31,16.26 U24.5 | U15.P1 54.96,39.86 R9.2 | R8.2 60.55,39.86 U14.P1
  Top 1.016: R9.2 55.49,41.77 v55.63,41.91 | R8.2 61.08,41.79 v60.96,41.91
  Top 1.422: C50.2 v54.36,17.53
  Bottom 0.254: v55.5,35.94 v59.05,35.94 62.48,35.94 62.61,36.07
  Bottom 1.524: v55.63,41.91 v60.96,41.91 62.61,40.26 62.61,36.07 v62.61,34.67 62.61,24 60.2,21.59 56.01,21.59 54.36,19.68 v54.36,17.53
VCC_BACKPLANE  (via drill 0.25, 0.6)
  Top 0.254: v45.72,27.43 50.04,27.43 52.08,29.48 | U7.20 54.15,30.99 53.59,30.99 52.08,29.48 | U7.1 52.08,29.48 | v38.86,27.43 39.18,27.43 U6.20 | v26.67,45.72 26.16,45.72 | 24.89,44.45 26.16,45.72 | 24.89,44.45 24.89,43.39 U25.20 | U25.2 22.4,44.24 22.86,44.7 24.64,44.7 24.89,44.45 | R43.2 26.92,49.53 26.42,49.02 26.16,49.02 | 26.16,49.02 25.48,49.02 R41.2 R42.2 | 26.16,45.72 26.16,49.02 | J1.2 47.5,59.69 54.1,53.09 54.1,52.63 U29.8 56.59,52.45 C23.1 56.72,50.47 SJ1.1 | v32.26,45.72 32.77,45.21 J3.6 | R16.2 17.86,28.37 v18.29,27.94 17.86,27.51 R15.2
  Top 0.406: U8.6 37.31,17.67 R2.1 | 34.99,19.18 C1.1
  Top 0.813: R2.1 35.73,19.25 C1.1 33.83,19.25 v33.78,19.3
  Route2 0.254: v32.26,45.72 30.99,45.72
  Route2 0.508: 30.99,57.66 31.5,58.17 31.5,60.96 J1.13 | v38.86,27.43 30.99,27.43
  Route2 1.524: v33.78,19.3 30.99,22.1 v30.99,23.62 30.99,27.43 30.99,45.72 30.99,57.66
  Route15 0.254: v30.99,23.62 22.61,23.62 v18.29,27.94
  Bottom 0.254: v38.86,27.43 v45.72,27.43 | v26.67,45.72 v32.26,45.72
  Bottom 0.406: J1.2 45.72,59.69
  Bottom 0.508: J1.13 30.23,62.99 30.99,63.75 43.18,63.75 44.2,62.74 44.2,60.96 J1.2
VCC_LINUX  (via drill 0.6)
  Top 0.406: 43.93,16.88 R3.1 43.41,17.67 43.41,18.29 | U9.P8 43.41,18.29 | C2.1 43.41,18.29
  Top 1.016: 43.93,16.88 42.8,15.75 37.06,15.75 35.78,17.03 33.52,17.03 v29.46,21.08
  Route2 0.406: 28.96,58.06 28.96,57.91 29.21,57.66
  Route2 0.508: 28.96,58.06 28.96,62.74 29.97,63.75 43.18,63.75 44.2,62.74 44.2,60.96 J1.4
  Route2 1.524: v29.46,21.08 29.21,21.34 29.21,57.66
VCC_MOD0  (via drill 0.6)
  Top 0.406: 49.94,37.32 50.98,37.32 C3.1 | U10.P8 49.93,37.32 49.94,37.32 | 49.94,37.32 49.94,37.58 R4.1
  Top 1.016: v46.35,41.4 47.5,41.4 49.41,39.49 R4.1 | v46.23,54.1 46.35,54.1 v46.35,48.51
  Bottom 0.406: J1.7 39.12,60.96 41.15,60.96 41.66,60.45 41.66,58.67 v46.23,54.1
  Bottom 1.016: v46.35,41.4 v46.35,48.51
VCC_MOD1  (via drill 0.6)
  Top 0.406: J1.8 v37.85,53.34 | U11.P8 43.58,37.35 | 43.58,37.35 44.5,37.35 arc-45 C4.1 | 43.58,37.35 43.58,37.71 R5.1
  Top 1.016: R5.1 43.06,38.75 44.45,40.13 v44.45,41.4
  Bottom 1.016: v37.85,53.34 41.27,53.34 44.45,50.16 v44.45,41.4
VCC_MOD2  (via drill 0.25, 0.6)
  Top 0.406: R6.1 50.9,20.08 50.9,20.09 U12.P8 49.7,21.35 C5.1 | J1.9 36.58,60.96 v36.58,56.9 | C5.1 | C5.1 49.45,21.92 v49.02,22.61
  Bottom 0.406: v36.58,56.9 36.58,56.77
  Bottom 1.016: 36.58,56.77 38.1,55.24 41.27,55.24 46.84,49.68 47.52,49 50.8,45.72 50.8,27.94 49.02,26.16 v49.02,22.61
VCC_MOD5  (via drill 0.25)
  Top 0.406: R7.1 58.27,20.08 U13.P8 56.33,21.35 C6.1 56.06,23.41 56.52,23.87 56.52,25.27 v56.39,25.4
  Bottom 0.406: J1.10 35.56,59.69
  Bottom 1.016: 35.56,59.69 38.1,57.15 41.27,57.15 52.07,46.35 52.07,29.72 v56.39,25.4
VCC_MOD6
  Top 0.406: J1.11 34.04,60.96 34.04,57.4 34.29,57.15 | R8.1 63.4,39.86 63.4,39.12 | C7.1 63.48,39.19 63.4,39.12 | 57.91,46.61 57.66,46.35 | 63.4,39.12 U14.P8
  Top 1.016: 34.29,57.15 34.29,52.58 40.51,46.35 57.66,46.35 58.29,46.35 62.88,41.77 R8.1
  pour Top: 33.78,57.15 33.78,57.72 arc-11 33.79,57.85 33.91,58.42 34.16,58.42 34.74,57.39 arc-29 34.8,57.15
VCC_MOD7
  Top 0.406: U15.P8 57.81,39.12 | 57.81,39.12 57.81,39.86 R9.1 | C8.1 57.89,39.19 57.81,39.12
  Top 1.016: R9.1 57.29,42.03 54.23,45.09 40.01,45.09 32.77,52.32 J1.12
VFB
  Top 0.254: U16.7 24.06,25.1 R64.1 R58.1
VINREG
  Top 0.254: R44.2 R57.1 16.39,29.97 19.26,29.97 20.1,29.13 U16.2 | R44.2 15.56,26.48 14.48,25.4 12.45,25.4 11.18,26.67 R12.1 | U17.6 16.13,21.97 17.02,22.86 17.02,25.03 R44.2
VSOL+
  Top 0.254: 23.45,54.94 23.62,55.12 | R11.2 23.62,55.12 | 23.5,55.24 23.62,55.12 | 23.5,55.24 22.86,55.88 | 20.07,58.17 20.32,58.42 | 23.5,55.24 23.47,55.22 U26.P1 23.21,53.59 C20.1
  Top 0.406: 19.81,58.93 20.32,58.42
  Top 2.54: 22.86,55.88 20.32,58.42 20.32,60.96 21.59,62.23 J1.19
  Route15 0.813: JP1.2 4.83,24.13 4.83,39.12 16,50.29 16,55.63 J1.19
VSOL_SENSE  (via drill 0.25, 0.6)
  Top 0.254: U26.P8 26.31,54.6 R11.1 | U16.3 20.34,28.68 20.32,28.7 19.68,28.7 v19.56,28.83 | v21.08,30.48 21.16,30.41 U16.1 20.23,29.58 19.43,30.38 14.11,30.38 14.09,30.36 | 14.09,30.36 13.58,29.85 R57.2 v14.48,28.96 | 14.09,30.36 C40.P$1 14.49,30.73 | U17.4 9.02,20.7 8.38,21.34 8.38,25.91 v11.43,28.96
  Top 1.27: R11.1 v26.92,55.12
  Route15 2.54: v26.92,55.12 27.69,55.12 29.46,53.34 29.46,40.13 21.84,32.51 21.84,31.24 v21.08,30.48
  Bottom 0.254: v19.56,28.83 19.56,28.96 v21.08,30.48 | v11.43,28.96 v14.48,28.96
WDI
  Top 0.254: J1.16 27.69,56.39 28.19,55.88 28.19,39.12 27.18,38.1 18.8,38.1 17.53,36.83 16.73,36.83 U27.6

## Text on the board
tPlace: Signpost / Power Module / Neal Jackson / 5/2017
tNames: VSOL+ | VBAT+ | BACK | MOD6 | MOD2 | MOD0 | SMBCLK | SMBDATA | GND | VSOL- | VBAT- | WDI | MOD7 | MOD5 | MOD1 | !INT | LINUX | BACK | SMBUS / Header | OFF | Watchdog Enable | ON | VBAT+ | VBAT- | VSOL+ | GND
tDocu: !WC